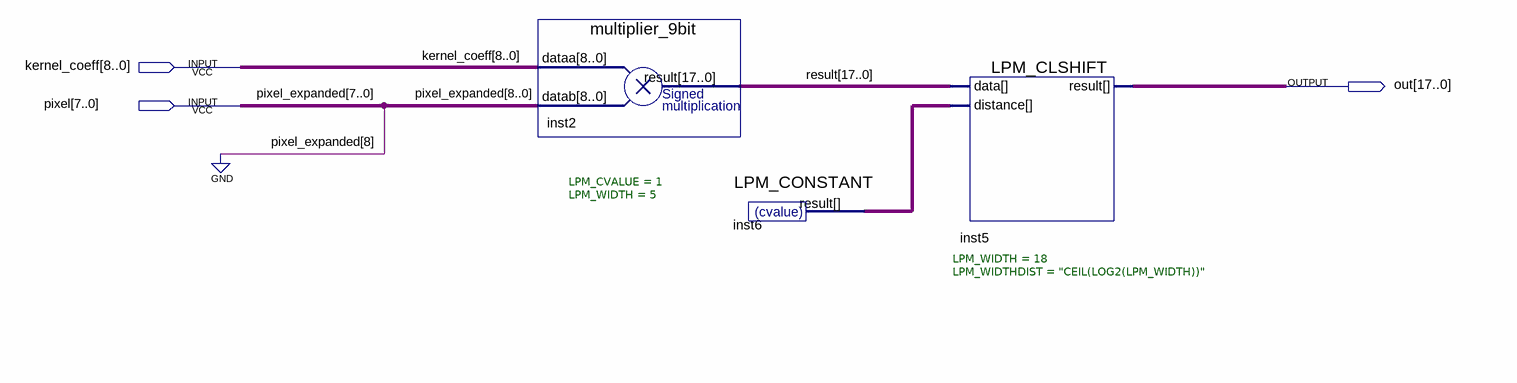
[diagram p0: schematic sheet]
// Quartus schematic multiplier.bdf as structural Verilog: 3 symbols, 3 pins
module multiplier (
  input  [8:0] kernel_coeff,
  input  [7:0] pixel,
  output [17:0] out
);

  wire [4:0] inst6_result;
  wire [17:0] result;

  multiplier_9bit inst2 (.dataa(kernel_coeff), .datab({1'b0, pixel}), .result(result));
  LPM_CONSTANT #(.LPM_CVALUE(1), .LPM_WIDTH(5)) inst6 (.result(inst6_result));
  LPM_CLSHIFT #(.LPM_WIDTH(18), .LPM_WIDTHDIST("CEIL(LOG2(LPM_WIDTH))")) inst5 (
    .data(result), .distance(inst6_result), .result(out));  // open: port

  // Other names for the same wires on the sheet: pixel_expanded[7:0] = pixel
endmodule
